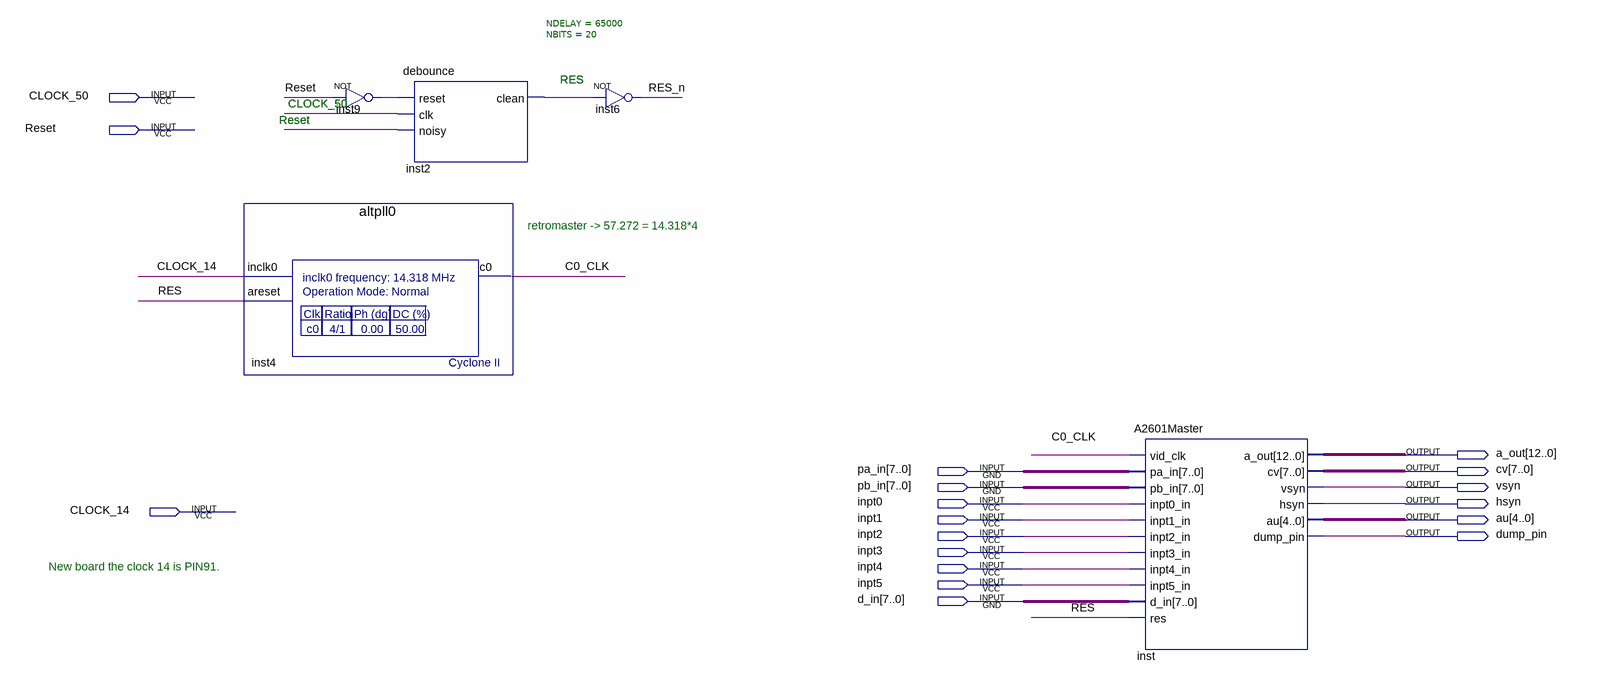
[diagram p0: schematic sheet]
// Quartus schematic retro2600.bdf as structural Verilog: 5 symbols, 18 pins
module retro2600 (
  input  CLOCK_50,
  input  Reset,
  input  [7:0] pa_in,
  input  [7:0] pb_in,
  input  inpt0,
  input  CLOCK_14,
  input  inpt1,
  input  inpt2,
  input  inpt3,
  input  inpt4,
  input  inpt5,
  input  [7:0] d_in,
  output [12:0] a_out,
  output [7:0] cv,
  output vsyn,
  output hsyn,
  output [4:0] au,
  output dump_pin
);

  wire C0_CLK, inst9_out, RES, RES_n;

  altpll0 inst4 (.inclk0(CLOCK_14), .areset(RES), .c0(C0_CLK));
  not inst9 (inst9_out, Reset);
  debounce #(.NDELAY(65000), .NBITS(20)) inst2 (.reset(inst9_out), .clk(CLOCK_50), .noisy(Reset), .clean(RES));
  not inst6 (RES_n, RES);
  A2601Master inst (
    .vid_clk(C0_CLK), .pa_in(pa_in), .pb_in(pb_in), .inpt0_in(inpt0), .inpt1_in(inpt1), .inpt2_in(inpt2),
    .inpt3_in(inpt3), .inpt4_in(inpt4), .inpt5_in(inpt5), .d_in(d_in), .res(RES), .a_out(a_out), .cv(cv),
    .vsyn(vsyn), .hsyn(hsyn), .au(au), .dump_pin(dump_pin));

  // Notes on the sheet:
  //   RES
  //   RES
  //   CLOCK_50
  //   Reset
  //   retromaster -> 57.272 = 14.318*4
  //   New board the clock 14 is PIN91.
endmodule
